# Altium schematic sheet P12 Spi Nor Flash.SchDoc
size 420 x 297 mm
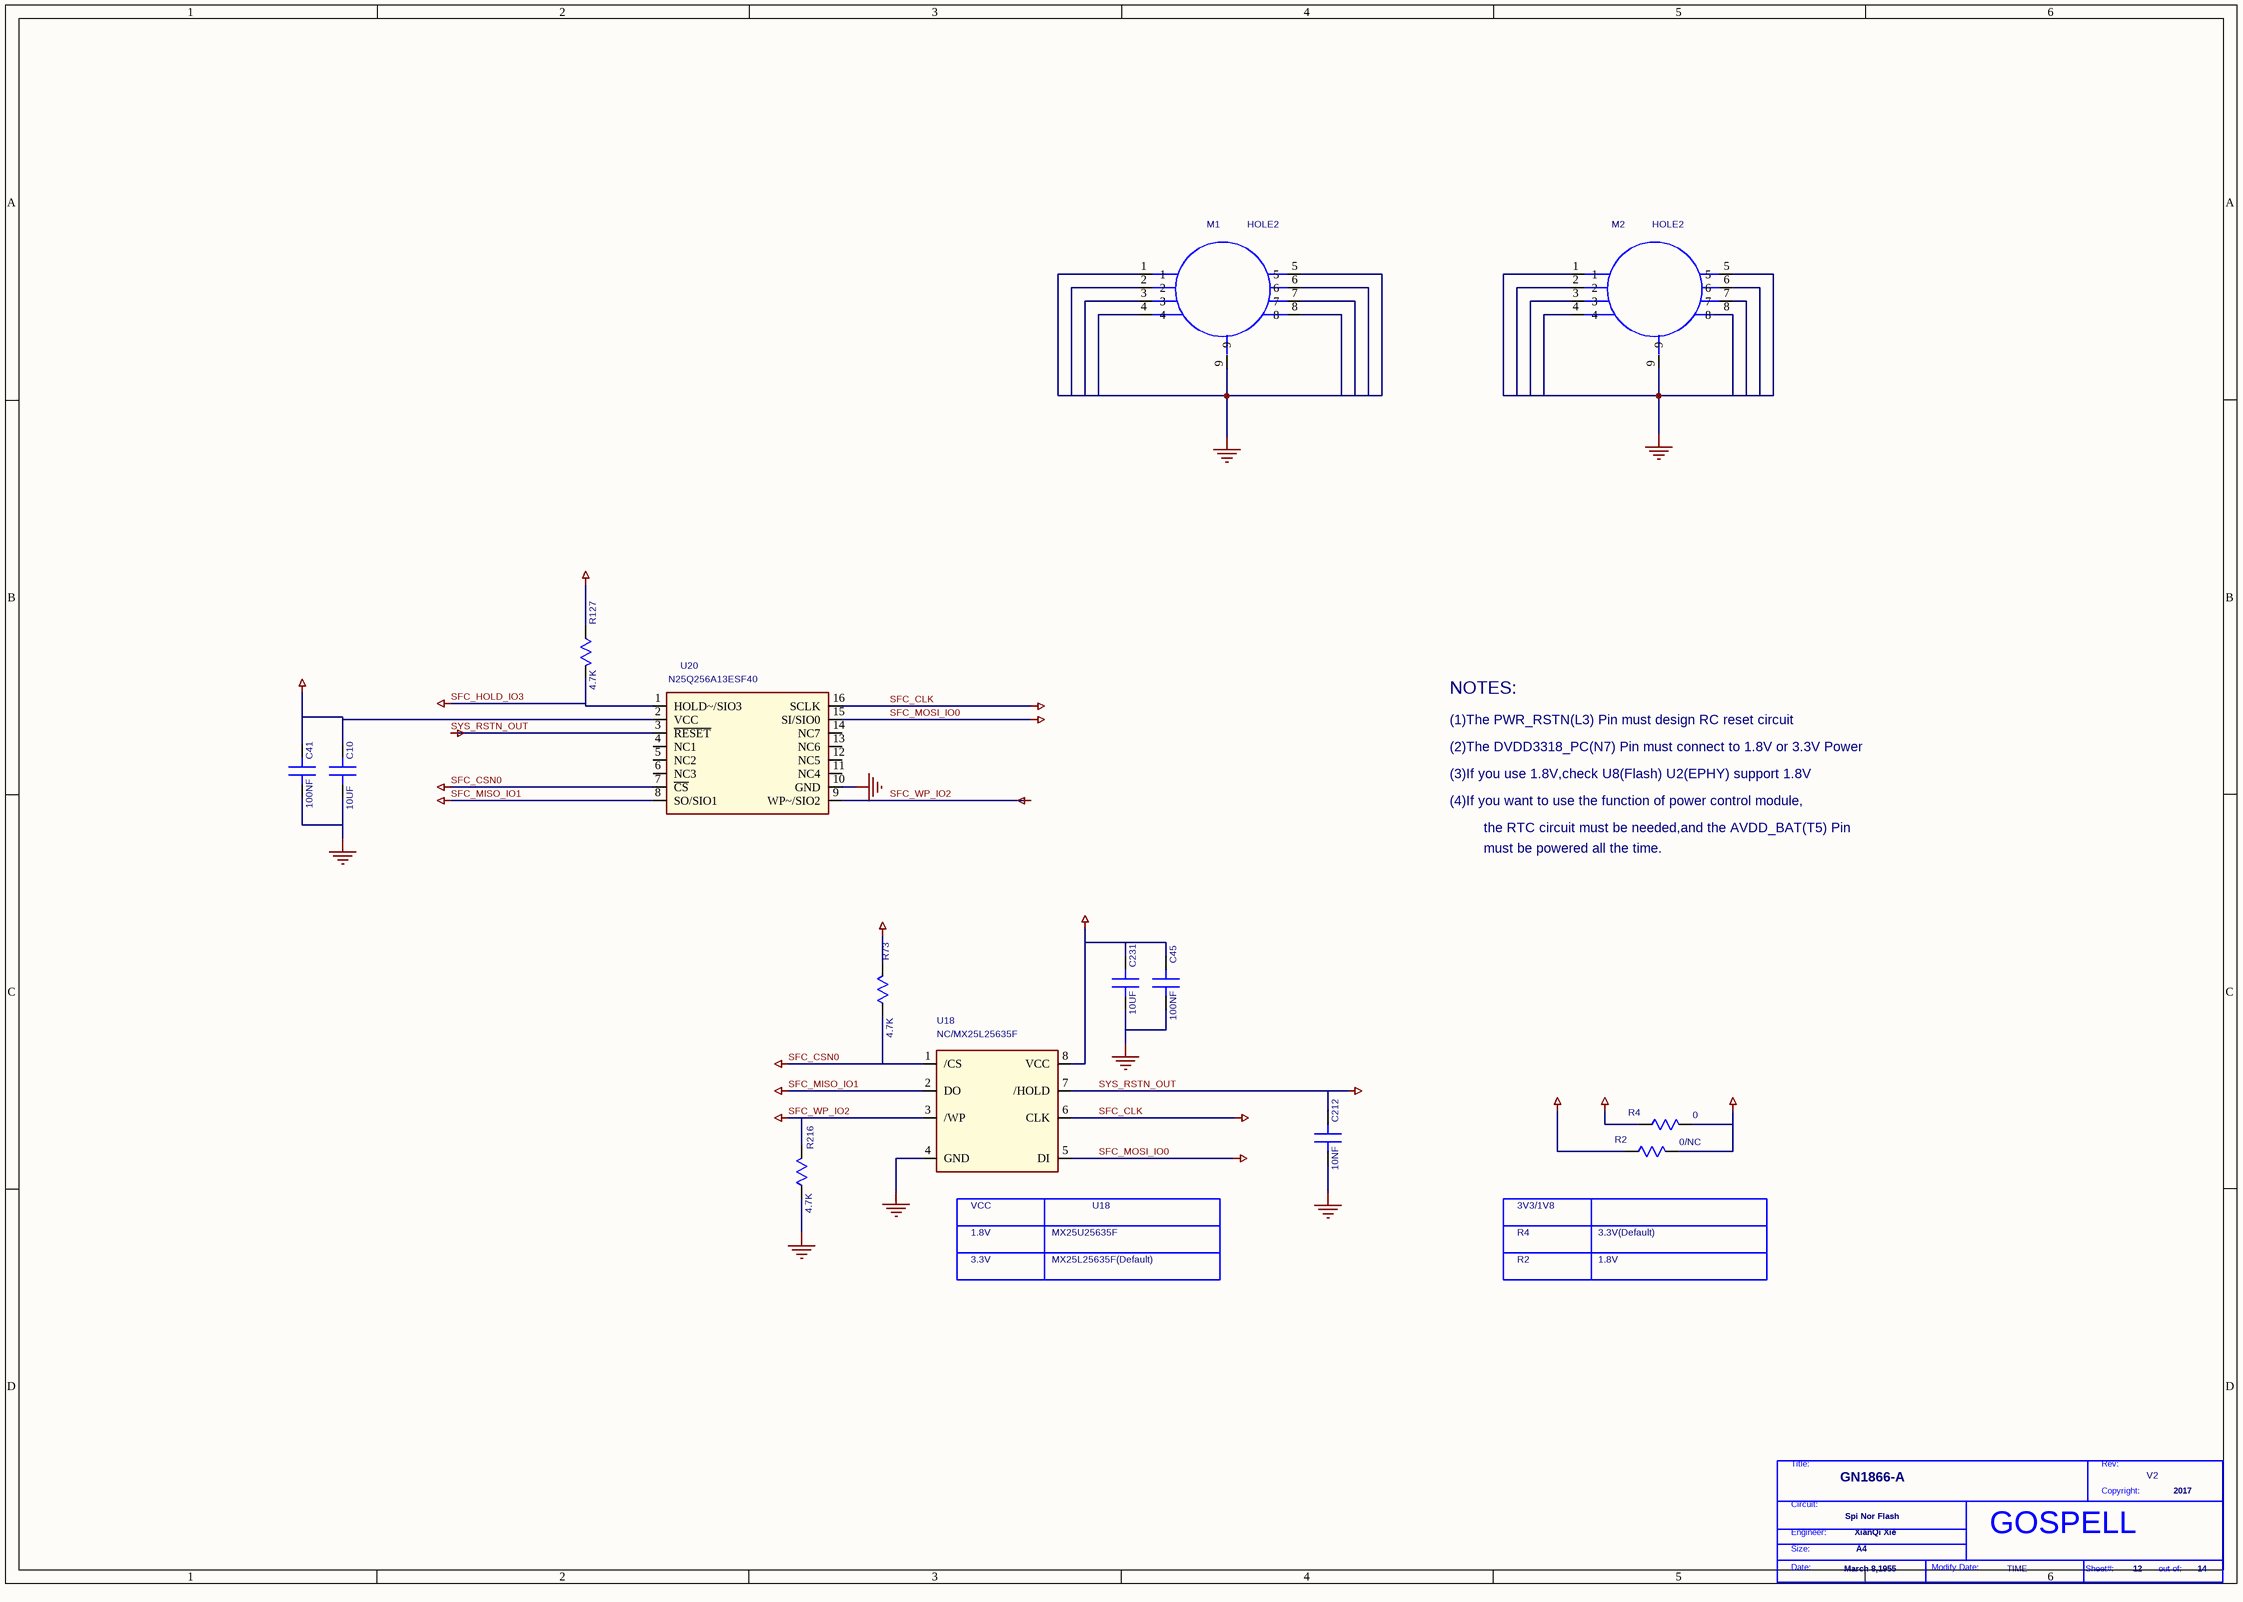
[diagram p0: P12 Spi Nor Flash.SchDoc]

## Parts
*  Page Modify Date: TIME  Engineer: XianQi Xie  Copyright: 2017  Title: GN1866-A  RevCode: V2  Page Size: A4  Page Create Date: March 8,1955  Page Number: 12  Page Count: 14  Doc: Spi Nor Flash  (hidden comment: GOSPELL)  (graphical)
C10  10UF  [SC0603]
C41  100NF  [SC0402]
C45  100NF  [SC0402]
C212  10NF  [SC0402]
C231  10UF  [SC0603]
M1  DEVICE: HOLE2  [HOLE160-8STARAN]  (hidden comment: NC)
M2  DEVICE: HOLE2  [HOLE160-8STARAN]  (hidden comment: NC)
R2  0/NC  [SR0402]
R4  0  [SR0402]
R73  4.7K  [SR0402]
R127  4.7K  [SR0402]
R216  4.7K  [SR0402]
U18  DEVICE: NC/MX25L25635F  [WSON8-50-0806L]  (hidden comment: W25Q128BV)
U20  DEVICE: N25Q256A13ESF40  [SOP16-50-300A]  (hidden comment: MX25L25635EMI-12G)

## Nets
1V8: R2.1(A)
3V3: R4.1(A)
3V3/1V8: C10.1(A) C41.1(A) C45.1(A) C231.1(A) R2.2(B) R4.2(B) R73.2(B) R127.1(A) U18.8(VCC) U20.2(VCC)
GND: C10.2(B) C41.2(B) C45.2(B) C212.2(B) C231.2(B) M1.1 M1.2 M1.3 M1.4 M1.5 M1.6 M1.7 M1.8 M1.9 M2.1 M2.2 M2.3 M2.4 M2.5 M2.6 M2.7 M2.8 M2.9 R216.1(A) U18.4(GND) U20.10(GND)
SFC_CLK: U18.6(CLK) U20.16(SCLK)
SFC_CSN0: R73.1(A) U18.1(/CS) U20.7(~{CS})
SFC_HOLD_IO3: R127.2(B) U20.1(HOLD~/SIO3)
SFC_MISO_IO1: U18.2(DO) U20.8(SO/SIO1)
SFC_MOSI_IO0: U18.5(DI) U20.15(SI/SIO0)
SFC_WP_IO2: R216.2(B) U18.3(/WP) U20.9(WP~/SIO2)
SYS_RSTN_OUT: C212.1(A) U18.7(/HOLD) U20.3(~{RESET})

Not connected (* = marked no-connect by the designer): U20 4(NC1) 5(NC2) 6(NC3) 11(NC4) 12(NC5) 13(NC6) 14(NC7)

## Notes on the sheet
- (1)The PWR_RSTN(L3) Pin must design RC reset circuit
- NOTES:
- (3)If you use 1.8V,check U8(Flash) U2(EPHY) support 1.8V
- (2)The DVDD3318_PC(N7) Pin must connect to 1.8V or 3.3V Power
- (4)If you want to use the function of power control module,
- the RTC circuit must be needed,and the AVDD_BAT(T5) Pin
- must be powered all the time.
- (near U18) VCC
- U18
- 3V3/1V8
- 3.3V
- 1.8V
- MX25L25635F(Default)
- MX25U25635F
- R2
- R4
- 3.3V(Default)
- (in symbol GOSPELL) Title:; Rev:; Copyright:; Circuit:; Engineer:; Size:; Date:; Modify Date:; Sheet#:; out of:

## Library data of the parts
C10 = C_0: PARTS: 1; PINSWAP: (A,B); LEVEL: STD; DEVICE: C1608X5R0J106MT0A0E; OriginalSymbolOrigin: (0,30); %208%%161%%192%%224%%195%%251%%179%%198%: SMD陶瓷电容; COMPONENT_HIGH_MAX: 0.9MM; %182%%238%%182%%168%%185%%164%%215%%247%%181%%231%%209%%185%(V): 6.3; %195%%232%%202%%246%: SMD陶瓷电容-6.3V-10000NF-+/-20%-X5R-0603-BT,TS16949; CODE: 8070649; GVALUE: C  6.3V  10uF +80%~-20%  X5R 0603; PKG_TYPE: SC0603
C41 = C_0_Dup1: PARTS: 1; OriginalSymbolOrigin: (0,30); DEVICE: RMEMK105BJ104KV_FR; LEVEL: STD; PINSWAP: (A,B); GVALUE: C 16V  0.1uF +80%~-20%  X7R 0402; %208%%161%%192%%224%%195%%251%%179%%198%: SMD陶瓷电容; COMPONENT_HIGH_MAX: 0.55MM; %182%%238%%182%%168%%185%%164%%215%%247%%181%%231%%209%%185%(V): 16; %195%%232%%202%%246%: SMD陶瓷电容-16V-100NF-+/-10%-X7R-0402-BT; CODE: 8070614; PKG_TYPE: SC0402
C45 = C_0_Dup2: PARTS: 1; OriginalSymbolOrigin: (0,30); DEVICE: RMEMK105BJ104KV_FR; LEVEL: STD; PINSWAP: (A,B); GVALUE: C 16V  0.1uF +80%~-20%  X7R 0402; %208%%161%%192%%224%%195%%251%%179%%198%: SMD陶瓷电容; COMPONENT_HIGH_MAX: 0.55MM; %182%%238%%182%%168%%185%%164%%215%%247%%181%%231%%209%%185%(V): 16; %195%%232%%202%%246%: SMD陶瓷电容-16V-100NF-+/-10%-X7R-0402-BT; CODE: 8070614; PKG_TYPE: SC0402
C212 = C_0_Dup2: PARTS: 1; OriginalSymbolOrigin: (0,30); DEVICE: GRM155R71C103KA01D; LEVEL: STD; PINSWAP: (A,B); CODE: 8070449; %195%%232%%202%%246%: SMD陶瓷电容-16V-10NF-+/-10%-X7R-0402-BT,TS16949; %182%%238%%182%%168%%185%%164%%215%%247%%181%%231%%209%%185%(V): 16; COMPONENT_HIGH_MAX: 0.56MM; %208%%161%%192%%224%%195%%251%%179%%198%: SMD陶瓷电容; GVALUE: C 16V  0.01uF +80%~-20%  X7R 0402; PKG_TYPE: SC0402
C231 = C_0_Dup2: PARTS: 1; OriginalSymbolOrigin: (0,30); DEVICE: C1608X5R0J106MT0A0E; LEVEL: STD; PINSWAP: (A,B); %208%%161%%192%%224%%195%%251%%179%%198%: SMD陶瓷电容; COMPONENT_HIGH_MAX: 0.9MM; %182%%238%%182%%168%%185%%164%%215%%247%%181%%231%%209%%185%(V): 6.3; %195%%232%%202%%246%: SMD陶瓷电容-6.3V-10000NF-+/-20%-X5R-0603-BT,TS16949; CODE: 8070649; GVALUE: C  6.3V  10uF +80%~-20%  X5R 0603; PKG_TYPE: SC0603
M1 M2 = HOLE2_2: PARTS: 1; OriginalSymbolOrigin: (0,89); LEVEL: STD; PKG_TYPE: MTH_C6MMD3P2MM; GVALUE: NC
R2 = R_0: PARTS: 1; OriginalSymbolOrigin: (10,20); PINSWAP: (A,B); DEVICE: RC0402JR_070R; LEVEL: STD; CODE: 7090800; %195%%232%%202%%246%: 片式厚膜电阻器-0.0625W-0OHM-< 50MOHM-0402-1A-BT; %182%%238%%182%%168%%185%%166%%194%%202%(W): 0.06; %215%%232%%214%%181%%212%%202%%208%%237%%198%%171%%178%%238%: < 50MOHM; COMPONENT_HIGH_MAX: 0.4MM; %208%%161%%192%%224%%195%%251%%179%%198%: 片式厚膜电阻器; GVALUE: NC; PKG_TYPE: SR0402
R4 = R_0: PARTS: 1; OriginalSymbolOrigin: (10,20); PINSWAP: (A,B); DEVICE: RC0402JR_070R; LEVEL: STD; %208%%161%%192%%224%%195%%251%%179%%198%: 片式厚膜电阻器; COMPONENT_HIGH_MAX: 0.4MM; %215%%232%%214%%181%%212%%202%%208%%237%%198%%171%%178%%238%: < 50MOHM; %182%%238%%182%%168%%185%%166%%194%%202%(W): 0.06; %195%%232%%202%%246%: 片式厚膜电阻器-0.0625W-0OHM-< 50MOHM-0402-1A-BT; CODE: 7090800; GVALUE: R 1/16W 0±5% 0402; PKG_TYPE: SR0402
R73 R216 = R_0: PARTS: 1; OriginalSymbolOrigin: (10,20); PINSWAP: (A,B); DEVICE: RK73B1ELTP472J; LEVEL: STD; CODE: 7090793; %195%%232%%202%%246%: 片式厚膜电阻器-0.0625W-4700OHM-+/-5%-0402-BT; %182%%238%%182%%168%%185%%166%%194%%202%(W): 0.06; %215%%232%%214%%181%%212%%202%%208%%237%%198%%171%%178%%238%: +/-5%; COMPONENT_HIGH_MAX: 0.4MM; %208%%161%%192%%224%%195%%251%%179%%198%: 片式厚膜电阻器; GVALUE: R 1/16W 4.7K±5% 0402; PKG_TYPE: SR0402
R127 = R_1: PARTS: 1; OriginalSymbolOrigin: (10,20); PINSWAP: (A,B); DEVICE: RK73B1ELTP472J; LEVEL: STD; CODE: 7090793; %195%%232%%202%%246%: 片式厚膜电阻器-0.0625W-4700OHM-+/-5%-0402-BT; %182%%238%%182%%168%%185%%166%%194%%202%(W): 0.06; %215%%232%%214%%181%%212%%202%%208%%237%%198%%171%%178%%238%: +/-5%; COMPONENT_HIGH_MAX: 0.4MM; %208%%161%%192%%224%%195%%251%%179%%198%: 片式厚膜电阻器; GVALUE: R 1/16W 4.7K±5% 0402; PKG_TYPE: SR0402
U18 = W25Q128BV_0: PARTS: 1; OriginalSymbolOrigin: (-5,110); LEVEL: STD; %195%%232%%202%%246%: MX25L25635-10G 256MBIT; CODE: HBVT3002; GVALUE: NC; PKG_TYPE: WSON8-50-0806L
U20 = MX25L25635EMI-12G_1: PARTS: 1; OriginalSymbolOrigin: (10,100); LEVEL: STD; CODE: HBVT3001; %195%%232%%202%%246%: SPI FLASH-256MBIT-50MHZ-64KB-3.3V-SOP16L-00425847; COMPONENT_HIGH_MAX: 2.65MM; GVALUE: N25Q256A13ESF40  WSO16 SPI FLASH; PKG_TYPE: SOP16-50-300A
* = GOSPELL: Cage Code: 2017